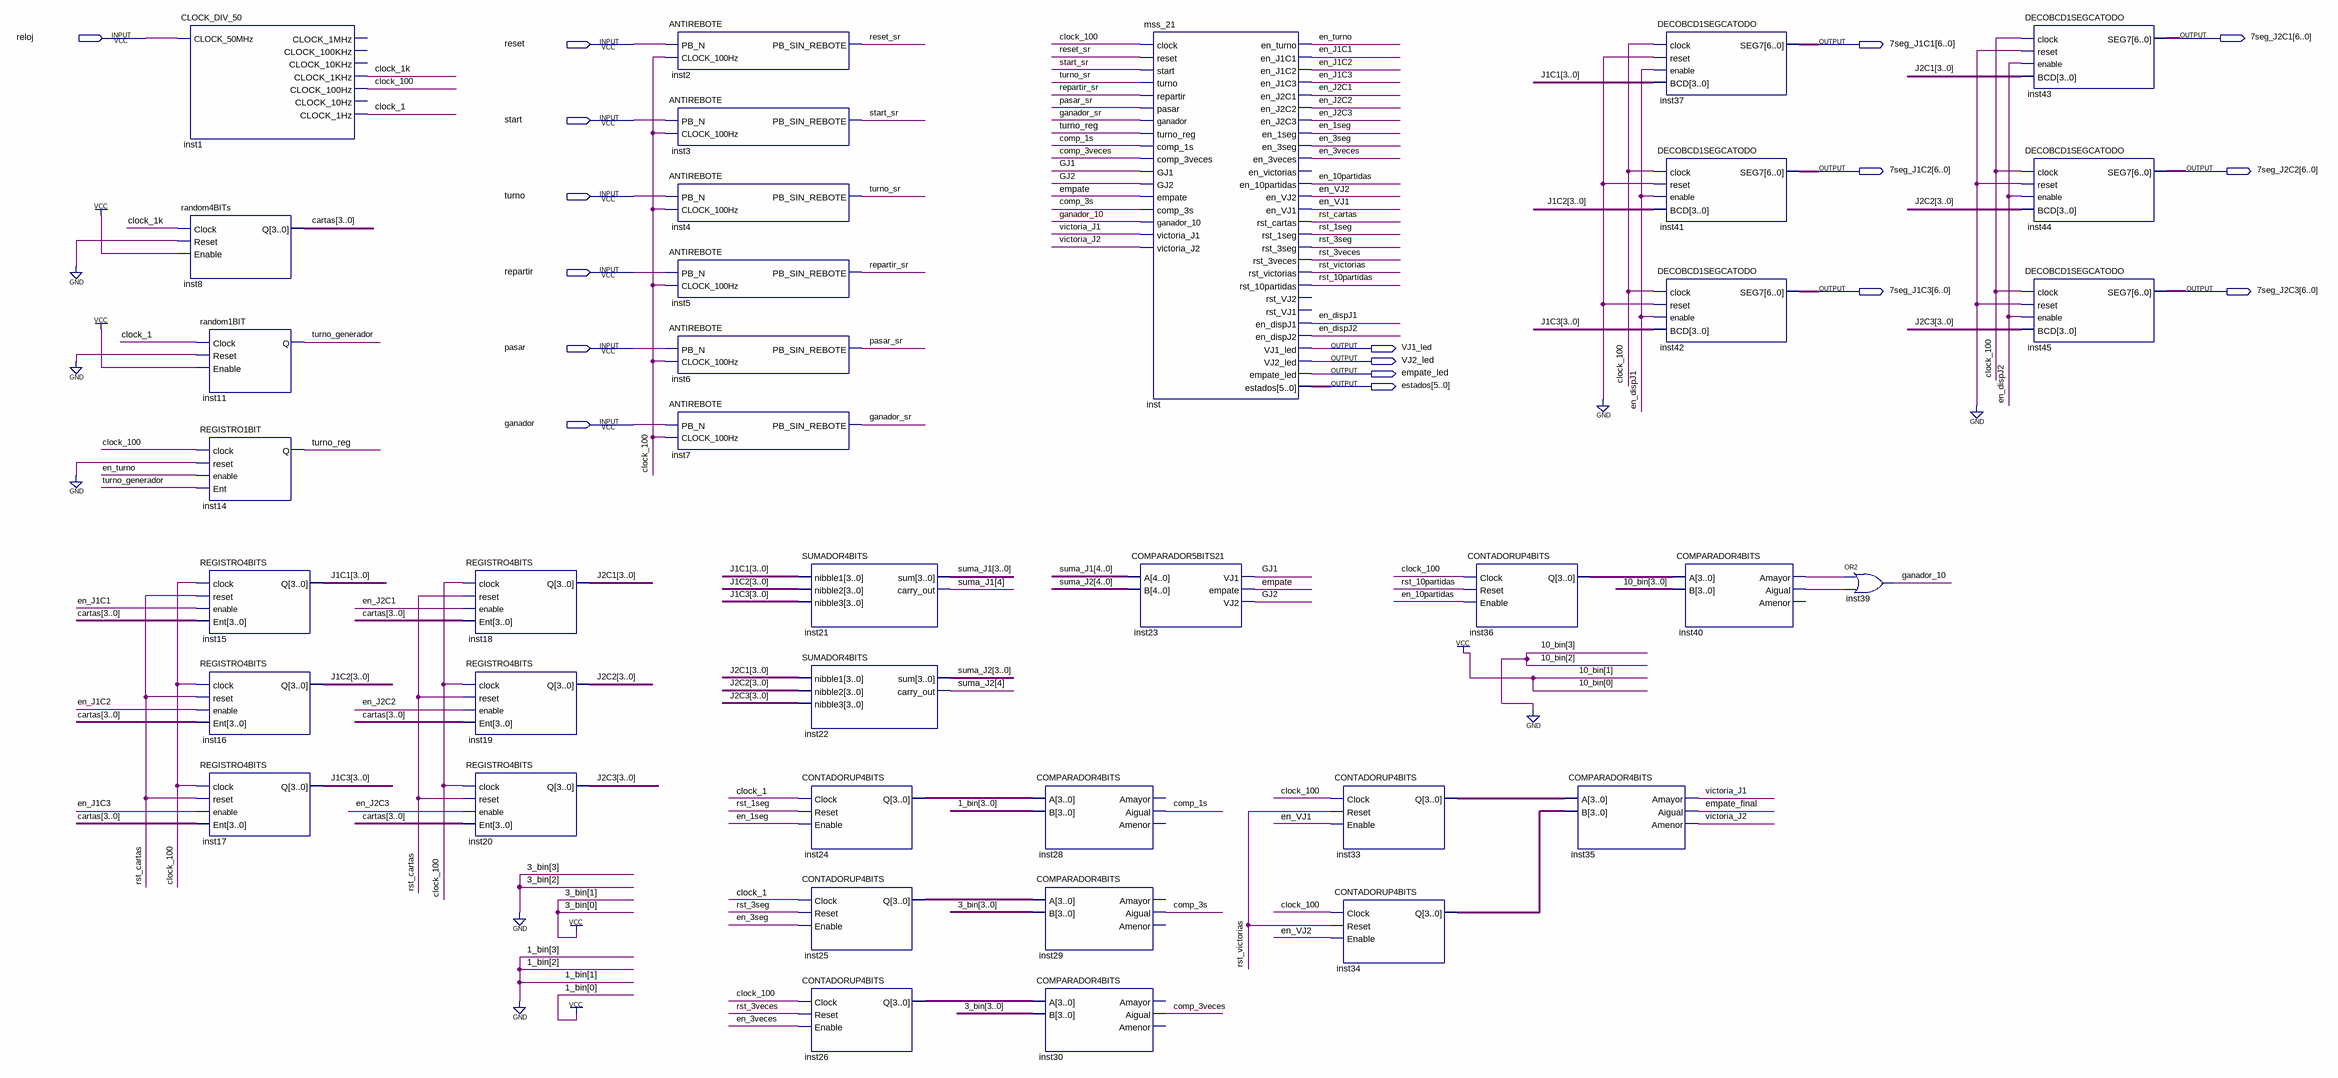
[diagram p0: schematic sheet]
// Quartus schematic proyecto_21.bdf as structural Verilog: 38 symbols, 17 pins
module proyecto_21 (
  input  reloj,
  input  reset,
  input  start,
  input  turno,
  input  repartir,
  input  pasar,
  input  ganador,
  output [6:0] \7seg_J2C1 ,
  output [6:0] \7seg_J1C1 ,
  output [6:0] \7seg_J1C2 ,
  output [6:0] \7seg_J2C2 ,
  output [6:0] \7seg_J1C3 ,
  output [6:0] \7seg_J2C3 ,
  output VJ1_led,
  output VJ2_led,
  output empate_led,
  output [5:0] estados
);

  wire clock_1, clock_1k, clock_100, comp_1s, comp_3s, comp_3veces, empate, empate_final, en_1seg, en_3seg,
       en_3veces, en_10partidas, en_dispJ1, en_dispJ2, en_J1C1, en_J1C2, en_J1C3, en_J2C1, en_J2C2, en_J2C3,
       en_turno, en_VJ1, en_VJ2, ganador_10, ganador_sr, GJ1, GJ2, inst40_aigual, inst40_amayor, pasar_sr,
       repartir_sr, reset_sr, rst_1seg, rst_3seg, rst_3veces, rst_10partidas, rst_cartas, rst_victorias,
       start_sr, turno_generador, turno_reg, turno_sr, victoria_J1, victoria_J2;
  wire [3:0] cartas, inst24_q, inst25_q, inst26_q, inst33_q, inst34_q, inst36_q, J1C1, J1C2, J1C3, J2C1,
       J2C2, J2C3;
  wire [4:0] suma_J1, suma_J2;

  CLOCK_DIV_50 inst1 (
    .CLOCK_50MHz(reloj), .CLOCK_1KHz(clock_1k), .CLOCK_100Hz(clock_100), .CLOCK_1Hz(clock_1));  // open: CLOCK_1MHz, CLOCK_100KHz, CLOCK_10KHz, CLOCK_10Hz
  random4BITs inst8 (.Clock(clock_1k), .Reset(1'b0), .Enable(1'b1), .Q(cartas));
  random1BIT inst11 (.Clock(clock_1), .Reset(1'b0), .Enable(1'b1), .Q(turno_generador));
  REGISTRO1BIT inst14 (.clock(clock_100), .reset(1'b0), .enable(en_turno), .Ent(turno_generador), .Q(turno_reg));
  REGISTRO4BITS inst15 (.clock(clock_100), .reset(rst_cartas), .enable(en_J1C1), .Ent(cartas), .Q(J1C1));
  REGISTRO4BITS inst16 (.clock(clock_100), .reset(rst_cartas), .enable(en_J1C2), .Ent(cartas), .Q(J1C2));
  REGISTRO4BITS inst17 (.clock(clock_100), .reset(rst_cartas), .enable(en_J1C3), .Ent(cartas), .Q(J1C3));
  REGISTRO4BITS inst18 (.clock(clock_100), .reset(rst_cartas), .enable(en_J2C1), .Ent(cartas), .Q(J2C1));
  REGISTRO4BITS inst19 (.clock(clock_100), .reset(rst_cartas), .enable(en_J2C2), .Ent(cartas), .Q(J2C2));
  REGISTRO4BITS inst20 (.clock(clock_100), .reset(rst_cartas), .enable(en_J2C3), .Ent(cartas), .Q(J2C3));
  ANTIREBOTE inst2 (.PB_N(reset), .CLOCK_100Hz(clock_100), .PB_SIN_REBOTE(reset_sr));
  ANTIREBOTE inst3 (.PB_N(start), .CLOCK_100Hz(clock_100), .PB_SIN_REBOTE(start_sr));
  ANTIREBOTE inst4 (.PB_N(turno), .CLOCK_100Hz(clock_100), .PB_SIN_REBOTE(turno_sr));
  ANTIREBOTE inst5 (.PB_N(repartir), .CLOCK_100Hz(clock_100), .PB_SIN_REBOTE(repartir_sr));
  ANTIREBOTE inst6 (.PB_N(pasar), .CLOCK_100Hz(clock_100), .PB_SIN_REBOTE(pasar_sr));
  ANTIREBOTE inst7 (.PB_N(ganador), .CLOCK_100Hz(clock_100), .PB_SIN_REBOTE(ganador_sr));
  SUMADOR4BITS inst21 (.nibble1(J1C1), .nibble2(J1C2), .nibble3(J1C3), .sum(suma_J1[3:0]), .carry_out(suma_J1[4]));
  SUMADOR4BITS inst22 (.nibble1(J2C1), .nibble2(J2C2), .nibble3(J2C3), .sum(suma_J2[3:0]), .carry_out(suma_J2[4]));
  CONTADORUP4BITS inst24 (.Clock(clock_1), .Reset(rst_1seg), .Enable(en_1seg), .Q(inst24_q));
  CONTADORUP4BITS inst25 (.Clock(clock_1), .Reset(rst_3seg), .Enable(en_3seg), .Q(inst25_q));
  CONTADORUP4BITS inst26 (.Clock(clock_100), .Reset(rst_3veces), .Enable(en_3veces), .Q(inst26_q));
  COMPARADOR4BITS inst28 (.A(inst24_q), .B(4'b0001), .Aigual(comp_1s));  // open: Amayor, Amenor
  COMPARADOR4BITS inst29 (.A(inst25_q), .B(4'b0011), .Aigual(comp_3s));  // open: Amayor, Amenor
  COMPARADOR4BITS inst30 (.A(inst26_q), .B(4'b0011), .Aigual(comp_3veces));  // open: Amayor, Amenor
  mss_21 inst (
    .clock(clock_100), .reset(reset_sr), .start(start_sr), .turno(turno_sr), .repartir(repartir_sr),
    .pasar(pasar_sr), .ganador(ganador_sr), .turno_reg(turno_reg), .comp_1s(comp_1s),
    .comp_3veces(comp_3veces), .GJ1(GJ1), .GJ2(GJ2), .empate(empate), .comp_3s(comp_3s),
    .ganador_10(ganador_10), .victoria_J1(victoria_J1), .victoria_J2(victoria_J2), .en_turno(en_turno),
    .en_J1C1(en_J1C1), .en_J1C2(en_J1C2), .en_J1C3(en_J1C3), .en_J2C1(en_J2C1), .en_J2C2(en_J2C2),
    .en_J2C3(en_J2C3), .en_1seg(en_1seg), .en_3seg(en_3seg), .en_3veces(en_3veces),
    .en_10partidas(en_10partidas), .en_VJ2(en_VJ2), .en_VJ1(en_VJ1), .rst_cartas(rst_cartas),
    .rst_1seg(rst_1seg), .rst_3seg(rst_3seg), .rst_3veces(rst_3veces), .rst_victorias(rst_victorias),
    .rst_10partidas(rst_10partidas), .en_dispJ1(en_dispJ1), .en_dispJ2(en_dispJ2), .VJ1_led(VJ1_led),
    .VJ2_led(VJ2_led), .empate_led(empate_led), .estados(estados));  // open: en_victorias, rst_VJ2, rst_VJ1
  COMPARADOR5BITS21 inst23 (.A(suma_J1), .B(suma_J2), .VJ1(GJ1), .empate(empate), .VJ2(GJ2));
  CONTADORUP4BITS inst33 (.Clock(clock_100), .Reset(rst_victorias), .Enable(en_VJ1), .Q(inst33_q));
  CONTADORUP4BITS inst34 (.Clock(clock_100), .Reset(rst_victorias), .Enable(en_VJ2), .Q(inst34_q));
  CONTADORUP4BITS inst36 (.Clock(clock_100), .Reset(rst_10partidas), .Enable(en_10partidas), .Q(inst36_q));
  COMPARADOR4BITS inst35 (
    .A(inst33_q), .B(inst34_q), .Amayor(victoria_J1), .Aigual(empate_final), .Amenor(victoria_J2));
  DECOBCD1SEGCATODO inst37 (.clock(clock_100), .reset(1'b0), .enable(en_dispJ1), .BCD(J1C1), .SEG7(\7seg_J1C1 ));
  DECOBCD1SEGCATODO inst41 (.clock(clock_100), .reset(1'b0), .enable(en_dispJ1), .BCD(J1C2), .SEG7(\7seg_J1C2 ));
  DECOBCD1SEGCATODO inst42 (.clock(clock_100), .reset(1'b0), .enable(en_dispJ1), .BCD(J1C3), .SEG7(\7seg_J1C3 ));
  COMPARADOR4BITS inst40 (.A(inst36_q), .B(4'b0011), .Amayor(inst40_amayor), .Aigual(inst40_aigual));  // open: Amenor
  or inst39 (ganador_10, inst40_amayor, inst40_aigual);
  DECOBCD1SEGCATODO inst43 (.clock(clock_100), .reset(1'b0), .enable(en_dispJ2), .BCD(J2C1), .SEG7(\7seg_J2C1 ));
  DECOBCD1SEGCATODO inst44 (.clock(clock_100), .reset(1'b0), .enable(en_dispJ2), .BCD(J2C2), .SEG7(\7seg_J2C2 ));
  DECOBCD1SEGCATODO inst45 (.clock(clock_100), .reset(1'b0), .enable(en_dispJ2), .BCD(J2C3), .SEG7(\7seg_J2C3 ));
endmodule
